# Altium schematic sheet 04-WPT-IC.SchDoc: WPT-IC
size A3; DocumentNumber: 4; SheetNumber: 4; SheetTotal: 5
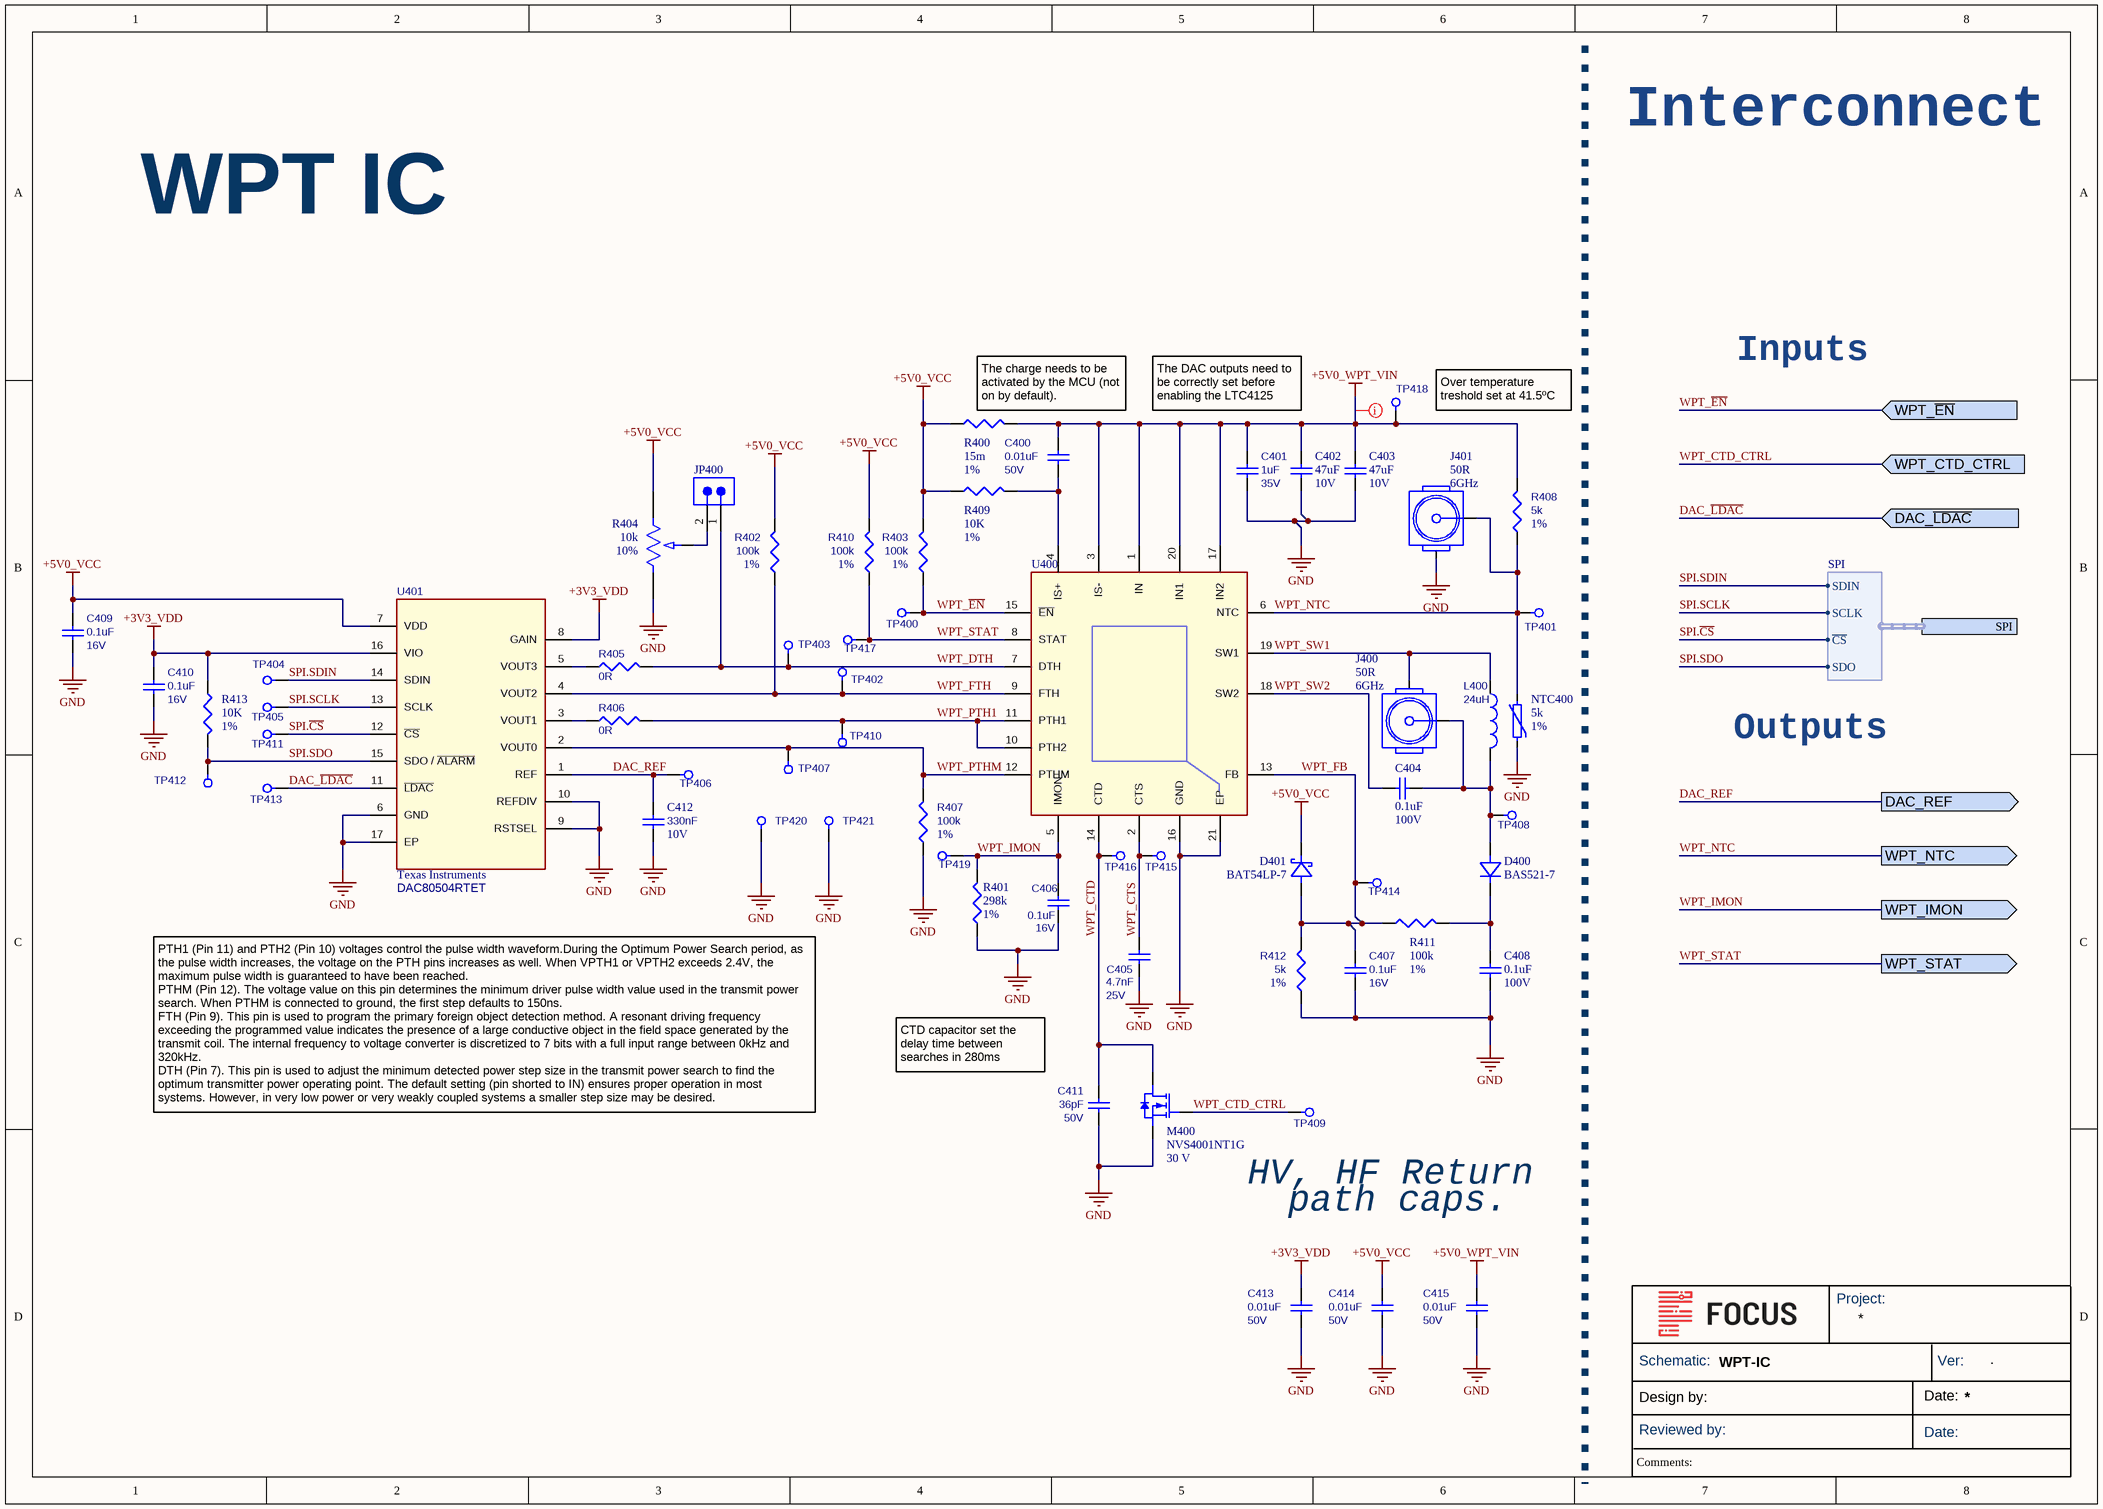
[diagram p0: 04-WPT-IC.SchDoc]

## Parts
C400  value 0.01uF  Rating: 50V  [C0402]  (hidden comment: GCM155R71H103KA55J)
C401  value 1uF  Rating: 35V  [C0402]  (hidden comment: GRM155R6YA105KE11D)
C402  value 47uF  Voltage Rating: 10V  [C0805]  (hidden comment: GRM21BR61A476ME15L)
C403  value 47uF  Voltage Rating: 10V  [C0805]  (hidden comment: GRM21BR61A476ME15L)
C404  value 0.1uF  Voltage Rating: 100V  [C1206]  (hidden comment: C3216C0G2A104J160AC)
C405  value 4.7nF  Rating: 25V  [C0402]  (hidden comment: GCM155R71E472KA37D)
C406  value 0.1uF  Rating: 16V  [C0402]  (hidden comment: GCM155R71C104KA55)
C407  value 0.1uF  Rating: 16V  [C0402]  (hidden comment: GCM155R71C104KA55)
C408  value 0.1uF  Voltage Rating: 100V  [C1206]  (hidden comment: C3216C0G2A104J160AC)
C409  value 0.1uF  Rating: 16V  [C0402]  (hidden comment: GCM155R71C104KA55)
C410  value 0.1uF  Rating: 16V  [C0402]  (hidden comment: GCM155R71C104KA55)
C411  value 36pF  Rating: 50V  [C0402]  (hidden comment: GCM1555C1H360FA16D)
C412  value 330nF  Rated DC Voltage (URdc): 10V  [C0402]  (hidden comment: GRM155R61A334KE15D)
C413  value 0.01uF  Rating: 50V  [C0402]  (hidden comment: GCM155R71H103KA55J)
C414  value 0.01uF  Rating: 50V  [C0402]  (hidden comment: GCM155R71H103KA55J)
C415  value 0.01uF  Rating: 50V  [C0402]  (hidden comment: GCM155R71H103KA55J)
D400  BAS521-7  [BAS521_SOD523]
D401  BAT54LP-7  [BAT54LP-7]
J400  Characteristic Impedance: 50R  Operating Frequency-Max: 6GHz  [FP-U_FL-R-SMT-1_10-MFG]  (hidden comment: U.FL-R-SMT-1(10))
J401  Characteristic Impedance: 50R  Operating Frequency-Max: 6GHz  [FP-U_FL-R-SMT-1_10-MFG]  (hidden comment: U.FL-R-SMT-1(10))
JP400  TSW-102-26-G-S  [SMTC-TSW-102-26-XX-S]  (value not drawn)
L400  value 24uH  [Coil_pads-5mm-ThroughHole]  (hidden comment: 760308100110)
M400  NVS4001NT1G  Vds breakdown: 30 V  [NVS4001NT1G-SC-70-3]
NTC400  value 5k  Tolerance: 1%  [NTC0603]  (hidden comment: NTCS0603E3502FLT)
R400  value 15m  Tolerance: 1%  [R0603]  (hidden comment: WSL0603R0150FEA18)
R401  value 298k  Tolerance: 1%  [R0402]  (hidden comment: RN73R1ETTP2983F50)
R402  value 100k  Tolerance: 1%  [R0402]  (hidden comment: ERJ-2RKF1003X)
R403  value 100k  Tolerance: 1%  [R0402]  (hidden comment: ERJ-2RKF1003X)
R404  value 10k  Tolerance: 10%  [RES3_64W_TTE]  (hidden comment: 64WR10KLF)
R405  value 0R  [R0402]  (hidden comment: ERJ-2GE0R00X)
R406  value 0R  [R0402]  (hidden comment: ERJ-2GE0R00X)
R407  value 100k  Tolerance: 1%  [R0402]  (hidden comment: ERJ-2RKF1003X)
R408  value 5k  Tolerance: 1%  [R0402]  (hidden comment: RC0402FR-075KL)
R409  value 10K  Tolerance: 1%  [R0402]  (hidden comment: CRCW040210K0FKED)
R410  value 100k  Tolerance: 1%  [R0402]  (hidden comment: ERJ-2RKF1003X)
R411  value 100k  Tolerance: 1%  [R0603]  (hidden comment: CRCW0603100KFKEAC)
R412  value 5k  Tolerance: 1%  [R0402]  (hidden comment: RC0402FR-075KL)
R413  value 10K  Tolerance: 1%  [R0402]  (hidden comment: CRCW040210K0FKED)
TP400  Test Point  [testpad_0.9mm]  (value not drawn)  (no BOM)
TP401  Test Point  [testpad_0.9mm]  (value not drawn)  (no BOM)
TP402  Test Point  [testpad_0.9mm]  (value not drawn)  (no BOM)
TP403  Test Point  [testpad_0.9mm]  (value not drawn)  (no BOM)
TP404  Test Point  [testpad_0.9mm]  (value not drawn)  (no BOM)
TP405  Test Point  [testpad_0.9mm]  (value not drawn)  (no BOM)
TP406  Test Point  [testpad_0.9mm]  (value not drawn)  (no BOM)
TP407  Test Point  [testpad_0.9mm]  (value not drawn)  (no BOM)
TP408  Test Point  [testpad_0.9mm]  (value not drawn)  (no BOM)
TP409  Test Point  [testpad_0.9mm]  (value not drawn)  (no BOM)
TP410  Test Point  [testpad_0.9mm]  (value not drawn)  (no BOM)
TP411  Test Point  [testpad_0.9mm]  (value not drawn)  (no BOM)
TP412  Test Point  [testpad_0.9mm]  (value not drawn)  (no BOM)
TP413  Test Point  [testpad_0.9mm]  (value not drawn)  (no BOM)
TP414  Test Point  [testpad_0.9mm]  (value not drawn)  (no BOM)
TP415  Test Point  [testpad_0.9mm]  (value not drawn)  (no BOM)
TP416  Test Point  [testpad_0.9mm]  (value not drawn)  (no BOM)
TP417  Test Point  [testpad_0.9mm]  (value not drawn)  (no BOM)
TP418  Test Point  [testpad_0.9mm]  (value not drawn)  (no BOM)
TP419  Test Point  [testpad_0.9mm]  (value not drawn)  (no BOM)
TP420  Test Point  [testpad_0.9mm]  (value not drawn)  (no BOM)
TP421  Test Point  [testpad_0.9mm]  (value not drawn)  (no BOM)
U400  LTC4125IUFD#TRPBF  [QFN50P400X500X80_HS-21N]  (value not drawn)
U401  Manufacturer: Texas Instruments  [DAC60504BRTET_16-WQFN]  (hidden comment: DAC80504RTET)

## Ports
DAC_REF (out), DAC_~{LDAC} (in), SPI (harness SPI), WPT_CTD_CTRL (in), WPT_IMON (out), WPT_NTC (out), WPT_STAT (out), WPT_~{EN} (in)

## Harnesses
SPI: SDIN, SCLK, ~{CS}, SDO

## Nets
+3V3_VDD: C410.2 C413.2 R413.1 U401.8(GAIN) U401.16(VIO)
+5V0_VCC: C409.2 C414.2 D401.1 R400.1 R402.2 R403.2 R404.1 R409.1 R410.2 U401.7(VDD)
+5V0_WPT_VIN: C400.2 C401.2 C402.2 C403.2 C415.2 R400.2 R408.2 TP418.1 U400.1(IN) U400.3(IS-) U400.17(IN2) U400.20(IN1)
GND: C401.1 C402.1 C403.1 C405.1 C406.1 C407.1 C408.1 C409.1 C410.1 C411.1 C412.1 C413.1 C414.1 C415.1 J401.2 M400.2(S) NTC400.1 R401.1 R404.3 R407.1 R412.1 TP420.1 TP421.1 U400.16(GND) U400.21(EP) U401.6(GND) U401.9(RSTSEL) U401.10(REFDIV) U401.17(EP)
DAC_~{LDAC}: TP413.1 U401.11(~{LDAC}) ; port DAC_~{LDAC}
DAC_REF: C412.2 TP406.1 U401.1(REF) ; port DAC_REF
SPI.~{CS}: TP411.1 U401.12(~{CS}) ; port SPI.~{CS}
SPI.SCLK: TP405.1 U401.13(SCLK) ; port SPI.SCLK
SPI.SDIN: TP404.1 U401.14(SDIN) ; port SPI.SDIN
SPI.SDO: R413.2 TP412.1 U401.15(SDO_/_~{ALARM}) ; port SPI.SDO
WPT_CTD: C411.2 M400.3(D) TP416.1 U400.14(CTD)
WPT_CTD_CTRL: M400.1(G) TP409.1 ; port WPT_CTD_CTRL
WPT_CTS: C405.2 TP415.1 U400.2(CTS)
WPT_DTH: JP400.1 R405.2 TP403.1 U400.7(DTH)
WPT_~{EN}: R403.1 TP400.1 U400.15(~{EN}) ; port WPT_~{EN}
WPT_FB: C407.2 D401.2 R411.1 R412.2 TP414.1 U400.13(FB)
WPT_FTH: R402.1 TP402.1 U400.9(FTH) U401.4(VOUT2)
WPT_IMON: C406.2 R401.2 TP419.1 U400.5(IMON) ; port WPT_IMON
WPT_NTC: J401.1 NTC400.2 R408.1 TP401.1 U400.6(NTC) ; port WPT_NTC
WPT_PTH1: R406.2 TP410.1 U400.10(PTH2) U400.11(PTH1)
WPT_PTHM: R407.2 TP407.1 U400.12(PTHM) U401.2(VOUT0)
WPT_STAT: R410.1 TP417.1 U400.8(STAT) ; port WPT_STAT
WPT_SW1: J400.2 L400.2 U400.19(SW1)
WPT_SW2: C404.2 U400.18(SW2)
NetC400_1: C400.1 R409.2 U400.4(IS+)
NetC404_1: C404.1 D400.2 J400.1 L400.1 TP408.1
NetC408_2: C408.2 D400.1 R411.2
NetJP400_2: JP400.2 R404.2
NetR405_1: R405.1 U401.5(VOUT3)
NetR406_1: R406.1 U401.3(VOUT1)

## Layout directives
net class POWER; rule Supply Nets [Voltage = 5.000]: +5V0_WPT_VIN

## Notes on the sheet
- Interconnect
- WPT IC
- Inputs
- (near R400) The charge needs to be activated by the MCU (not on by default).
- The DAC outputs need to be correctly set before enabling the LTC4125
- (near TP418) Over temperature treshold set at 41.5ºC
- Outputs
- PTH1 (Pin 11) and PTH2 (Pin 10) voltages control the pulse width waveform.During the Optimum Power Search period, as the pulse width increases, the voltage on the PTH pins increases as well. When VPTH1 or VPTH2 exceeds 2.4V, the maximum pulse width is guaranteed to have been reached.
  PTHM (Pin 12). The voltage value on this pin determines the minimum driver pulse width value used in the transmit power search. When PTHM is connected to ground, the first step defaults to 150ns.
  FTH (Pin 9). This pin is used to program the primary foreign object detection method. A resonant driving frequency exceeding the programmed value indicates the presence of a large conductive object in the field space generated by the transmit coil. The internal frequency to voltage converter is discretized to 7 bits with a full input range between 0kHz and 320kHz.
  DTH (Pin 7). This pin is used to adjust the minimum detected power step size in the transmit power search to find the optimum transmitter power operating point. The default setting (pin shorted to IN) ensures proper operation in most systems. However, in very low power or very weakly coupled systems a smaller step size may be desired.
- CTD capacitor set the delay time between searches in 280ms
- (near TP409) HV, HF Return
- path caps.
- Project:
- Schematic:
- Ver:
- .
- Design by:
- Reviewed by:
- Date:
- Comments:

## Library data of the parts
C400 C413-C415 = GCM155R71H103KA55J: Capacitor, 0.01uF, X7R, 50V, 10%, 0402, Implant-grade; Manufacturer: Murata; Medical Grade MFR PN: GCH155R71H103KE01; PCB Footprint: cap0402_reduced; Review: 020823; Length (mm): 1.00 ±0.05; Medical Grade MFR: Murata; Thickness (mm): 0.50 ±0.05; Width (mm): 0.50 ±0.05; Category: Capacitor; Package Description: 0402; Supplier 1: Arrow Electronics; Supplier Part Number 1: GCM155R71H103KA55J; Check: *; Status: Approved; Manufacturer Part Number: GCM155R71H103KA55J
C401 = GRM155R6YA105KE11D: 1 µF ±10% 35V Ceramic Capacitor X5R 0402 (1005 Metric); Manufacturer: Murata; Length (mm): 1.00 ±0.05; Manufacturer Part Number: GRM155R6YA105KE11D; Thickness (mm): 0.50 ±0.05; Width (mm): 0.50 ±0.05; Category: Capacitor; Package Description: 0402; Supplier 1: Digikey; Supplier Part Number 1: 490-10019-1-ND
C402 C403 = GRM21BR61A476ME15L: 47 µF ±20% 10V Ceramic Capacitor X5R 0805 (2012 Metric); Manufacturer: Murata; Category: Capacitor; Temperature Coefficient: X5R; Manufacturer Part Number: GRM21BR61A476ME15L; Size Code: 0805; Width: 1.25mm; Length: 2mm; Tolerance: 20%; Supplier 1: Digikey; Supplier Part Number 1: 490-9961-1-ND
C404 C408 = C3216C0G2A104J160AC: 0.1 µF ±5% 100V Ceramic Capacitor C0G, NP0 1206 (3216 Metric); Manufacturer: TDK Corporation; Category: Capacitor; Manufacturer Part Number: C3216C0G2A104J160AC; Size Code: 1206; Height: 1.8; Width: 1.6; Length: 3.2; Tolerance: 5%; Supplier 1: Digikey; Supplier Part Number 1: 445-172677-1-ND
C405 = GCM155R71E472KA37D: 4700 pF ±10% 25V Ceramic Capacitor X7R 0402 (1005 Metric); Manufacturer: Murata; Length (mm): 1.00 ±0.05; Manufacturer Part Number: GCM155R71E472KA37D; Thickness (mm): 0.50 ±0.05; Width (mm): 0.50 ±0.05; Category: Capacitor; Package Description: 0402; Supplier 1: Mouser; Supplier Part Number 1: 81-GCM155R71E472KA7D; Supplier 2: Digikey; Supplier Part Number 2: 490-GCM155R71E472KA37DCT-ND; Supplier 3: Digikey; Supplier Part Number 3: 490-GCM155R71E472KA37DDKR-ND; Supplier 4: Digikey; Supplier Part Number 4: 490-GCM155R71E472KA37DTR-ND
C406 C407 C409 C410 = GCM155R71C104KA55: Capacitor, 0.1uF, X7R, 16V, 10%, 0402, Implant-grade; Manufacturer: Murata; Medical Grade MFR PN: GCH155R71C104KE01; PCB Footprint: cap0402_reduced; Length (mm): 1.00 ±0.05; Manufacturer Part Number: GCM155R71C104KA55; Medical Grade MFR: Murata; Thickness (mm): 0.50 ±0.05; Width (mm): 0.50 ±0.05; Category: Capacitor; Package Description: 0402; Supplier 1: Digikey; Supplier Part Number 1: 490-4759-1-ND
C411 = GCM1555C1H360FA16D: 36 pF ±1% 50V Ceramic Capacitor C0G, NP0 0402 (1005 Metric); Manufacturer: Murata; Length (mm): 1.00 ±0.05; Manufacturer Part Number: GCM1555C1H360FA16D; Thickness (mm): 0.50 ±0.05; Width (mm): 0.50 ±0.05; Category: Capacitor; Package Description: 0402; Supplier 1: Digikey; Supplier Part Number 1: 490-GCM1555C1H360FA16DCT-ND
C412 = GRM155R61A334KE15D: Ceramic Capacitor, Multilayer, Ceramic, 10V, 10% +Tol, 10% -Tol, X5R, 15% TC, 0.33uF, Surface Mount, 0402; Manufacturer: Murata; Multilayer: Yes; Supplier: Arrow Electronics; Supplier Part Number: GRM155R61A334KE15D; Manufacturer Part Number: GRM155R61A334KE15D; RoHS: Yes; Category: Ceramic Capacitors; Stock: 42823; Pricing: 1=0,1103, 10=0,0933, 25=0,0752, 100=0,0508, 250=0,0502, 500=0,0438, 1000=0,0295, 3000=0,028, 6000=0,025, 15000=0,0191, 30000=0,0185 (USD); Mounting Technology: Surface Mount; Pins: 2; Dielectric Material: Ceramic; Package Shape: Rectangular; Case/Package: 0402; Terminal Finish: Nickel; Min Operating Temperature: -55°C; Max Operating Temperature: 85°C; JESD-609 Code: e3; Capacitor Type: Ceramic; Tolerance  (fill in as +-): 10%; Package Style: SMTMeter; Packaging: Tape and Reel; Tolerance (fill in as +-): 10%; Temperature Characteristics Code: X5R; Termination: Wraparound; Length: 1mm; Width: 0.5mm; Height: 0.5mm; Reach SVHC Compliant: Yes; RoHS Compliant: Yes; ComponentLink1URL: https://datasheet.ciiva.com:443/pdfs/VipMasterIC/IC/MURE/MURE-S-A0004362469/MURE-S-A0004364266-1.pdf?src-supplier=IHS+Markit; ComponentLink1Description: https://datasheet.ciiva.com:443/pdfs/VipMasterIC/IC/MURE/MURE-S-A0004362469/MURE-S-A0004364266-1.pdf?src-supplier=IHS+Markit; ComponentLink2URL: https://datasheet.ciiva.com/133/product-133232.pdf?src-supplier=Digi-Key; ComponentLink2Description: https://datasheet.ciiva.com/133/product-133232.pdf?src-supplier=Digi-Key; ComponentLink3URL: https://datasheet.ciiva.com/18184/getdatasheetpartid-223890-18184604.pdf?src-supplier=Verical; ComponentLink3Description: https://datasheet.ciiva.com/18184/getdatasheetpartid-223890-18184604.pdf?src-supplier=Verical; ComponentLink4URL: https://datasheet.ciiva.com/29200/453519-da-01-en-vs-kondensator-0402-29200242.pdf?src-supplier=Conrad; ComponentLink4Description: https://datasheet.ciiva.com/29200/453519-da-01-en-vs-kondensator-0402-29200242.pdf?src-supplier=Conrad; ComponentLink5URL: https://datasheet.ciiva.com/133/grm155r61a334ke15-01-133233.pdf?src-supplier=Digi-Key; ComponentLink5Description: https://datasheet.ciiva.com/133/grm155r61a334ke15-01-133233.pdf?src-supplier=Digi-Key; ComponentLink6URL: https://datasheet.ciiva.com/5421/product-5421467.pdf?src-supplier=Mouser; ComponentLink6Description: https://datasheet.ciiva.com/5421/product-5421467.pdf?src-supplier=Mouser; ComponentLink7URL: https://datasheet.ciiva.com/11463/product-11463963.pdf?src-supplier=Avnet; ComponentLink7Description: https://datasheet.ciiva.com/11463/product-11463963.pdf?src-supplier=Avnet; Supplier 1: Mouser; Supplier Part Number 1: 81-GRM155R61A334KE5D; Supplier 2: Digikey; Supplier Part Number 2: 490-3263-1-ND; Supplier 3: Digikey; Supplier Part Number 3: 490-3263-6-ND; Supplier 4: Digikey; Supplier Part Number 4: 490-3263-2-ND
D400 = BAS521-7: Diode 300 V 250mA Surface Mount SOD-523; Manufacturer: Diodes Incorporated; Type: General Purpose; Number of Channels: 1; Forward Voltage: 1.1V; Reverse Voltage: 300V; Reverse Current: 150nA; Diode Capacitance: 5pF; Category: Diode; Manufacturer Part Number: BAS521-7; Mounting Type: SMD; Forward Current: 250mA; Supplier 1: Digikey; Supplier Part Number 1: BAS521-7DICT-ND
D401 = BAT54LP-7: Diode 30 V 200mA Surface Mount X1-DFN1006-2; Manufacturer: Diodes Incorporated; Forward Voltage: 1V; Reverse Voltage: 30V; Reverse Leakage urrent: 2uA; Manufacturer Part Number: BAT54LP-7; Current: 200mA; Mounting type: SMD; Supplier 1: Digikey; Supplier Part Number 1: BAT54LPDICT-ND
J400 J401 = U.FL-R-SMT-1(10): RF Connector, 1 Contact(s), Male, Board Mount, Surface Mount Terminal, Receptacle; pin to pad: 2>2+3; Manufacturer: Hirose; Durability: 30Cycles; Insulation Resistance: 500MR; Number of Ports: 1; Option: General Purpose; Contact Resistance: 20mR; Contact Style: Coax; Coupling Type: Snap; Dielectric Withstanding Voltage (AC): 200V; Filter Feature: No; Mating Information: MULTIPLE MATING PARTS AVAILABLE; Panel Mount: No; VSWR: 1.5; Insertion Loss: 0.05dB; Body Depth: 0.098inch; Mounting Option 1: LOCKING; Body Diameter: 0.079inch; Reference Standard: UL; Reliability: COMMERCIAL; Supplier: Digi-Key; Supplier Part Number: H11891CT-ND; RoHS: Yes; Category: RF / Coaxial Connectors; Stock: 112692; Pricing: 1=1,35, 10=1,138, 25=1,092, 50=1,0686, 100=1,0221, 250=0,9292, 500=0,83628, 1000=0,74336 (USD); Mounting Technology: Board; Insulation Material: Polymer; Shell Finish: Silver; Shell Material: CuSn; Contact Material: Bronze; Contact Finish - Mating: GOLD; Contact Finish - Termination: GOLD; Insulation Color: Beige; Min Operating Temperature: -40°C; Max Operating Temperature: 90°C; Connector Type: RF CONNECTOR; Body/Shell Style: RECEPTACLE; Contact Gender: Male; Mounting Style: STRAIGHT; Termination: SMD/SMT; Number of Contacts: 1; JESD-609 Code: e4; Reach SVHC Compliant: Yes; RoHS Compliant: Yes; DIN Conformance: No; IEC Conformance: No; MIL Conformance: No; ComponentLink1URL: https://datasheet.ciiva.com:443/pdfs/VipMasterIC/IC/HIRO/HIROS10696/HIROS08829-1.pdf?src-supplier=IHS+Markit; ComponentLink1Description: https://datasheet.ciiva.com:443/pdfs/VipMasterIC/IC/HIRO/HIROS10696/HIROS08829-1.pdf?src-supplier=IHS+Markit; ComponentLink2URL: https://datasheet.ciiva.com/11762/0900766b8105243f-11762474.pdf?src-supplier=Rs; ComponentLink2Description: https://datasheet.ciiva.com/11762/0900766b8105243f-11762474.pdf?src-supplier=Rs; ComponentLink3URL: https://datasheet.ciiva.com/7651/91524-7651914.pdf?src-supplier=Element14; ComponentLink3Description: https://datasheet.ciiva.com/7651/91524-7651914.pdf?src-supplier=Element14; ComponentLink4URL: https://datasheet.ciiva.com/7651/91524-7651915.pdf?src-supplier=Element14; ComponentLink4Description: https://datasheet.ciiva.com/7651/91524-7651915.pdf?src-supplier=Element14; Manufacturer Part Number: U.FL-R-SMT-1(10); Supplier 1: Digikey; Supplier Part Number 1: H11891CT-ND
JP400 = TSW-102-26-G-S: Conn Unshrouded Header HDR 2 POS 2.54mm Solder ST Thru-Hole; Manufacturer: Samtec; Number of Contacts: 2; Gender: Male; Max Current Rating: 7.6A; Max Voltage Rating (AC): 550V; Orientation: Vertical; ComponentLink3Description: Package Specification; PackageReference: TSW-102-26-XX-S; Mounting Technology: Through-hole; ComponentLink2Description: Datasheet; ComponentLink1URL: http://www.samtec.com; DatasheetVersion: F-214; ComponentLink1Description: Manufacturer URL; RoHS: True; ComponentLink2URL: http://www.samtec.com/documents/webfiles/pdf/TSW_TH.PDF; PartNumber: TSW-102-26-G-S; ComponentLink3URL: http://www.samtec.com/documents/webfiles/cpdf/TSW-XXX-XX-XXX-X-XX-XXX-MKT.pdf; Pitch: 2.54 mm; PackageDescription: .025[0.64] SQ. Post Terminal Strip Assembly; PackageVersion: DM, 8/1988; Temperature Range: -55 to 125 degC; Supplier: Newark; Supplier Part Number: 12P1301; Manufacturer Part Number: TSW-102-26-G-S; Category: Connectors; Stock: 3117; Pricing: 1=0.51000, 10=0.47500, 100=0.33200, 500=0.28400, 1000=0.23700, 2500=0.21000, 5000=0.20400 (USD); Contact Plating: Gold; Contact Material: Bronze; Color: Black; Housing Material: Polyester; Contact Shape: Square; Contact Finish - Mating: GOLD; Insulation Color: Black; Insulation Material: PBT; Housing Color: Black; Min Operating Temperature: -55°C; Max Operating Temperature: 125°C; Number of Rows: 1; Packaging: Bulk; Termination: Solder; Number of Positions: 2; Connector Type: Header; Series: TSW; Contact Type: Male Pin; Fastening Type: Pull; Package Quantity: 1; Length: 5.08mm; Width: 2.54mm; Contact Mating Length: 0.23inch; Depth: 2.54mm; Radiation Hardening: No; RoHS Compliant: Yes; Flammability Rating: UL94 V-0; Lead Free: Lead Free; Reach SVHC Compliant: Yes; ComponentLink4URL: https://datasheet.ciiva.com/10281/htsw-th-10281416.pdf?src-supplier=Avnet; ComponentLink4Description: https://datasheet.ciiva.com/10281/htsw-th-10281416.pdf?src-supplier=Avnet; ComponentLink5URL: https://datasheet.ciiva.com/6887/tsw-xxx-xx-xxx-x-xx-xxx-mkt-6887237.pdf?src-supplier=Digi-Key; ComponentLink5Description: https://datasheet.ciiva.com/6887/tsw-xxx-xx-xxx-x-xx-xxx-mkt-6887237.pdf?src-supplier=Digi-Key; Supplier 1: Digikey; Supplier Part Number 1: SAM1077-02-ND
L400 = 760308100110: 1 Coil, 2 Layer 24µH Wireless Charging Coil Transmitter 70mOhm; Manufacturer: Wurth; Rating: 6A; Category: Coil; Diameter: 50mm; Manufacturer Part Number: 760308100110; Thickness: 6mm; Supplier 1: Digikey; Supplier Part Number 1: 732-5283-ND
M400 = NVS4001NT1G: N-Channel 30 V 270mA (Ta) 330mW (Ta) Surface Mount SC-70-3 (SOT323); Manufacturer: onsemi; Number of Channels: 1; Vgs max: ±20V; Vgs th: 1.2V; Rds On: 1Ohm; Category: Transistor; Type: N-MOS; Mounting Type: SMD; Power Dissipation: 330mW; Id, drain  DC current max: 270mA; Manufacturer Part Number: NVS4001NT1G; Supplier 1: Digikey; Supplier Part Number 1: NVS4001NT1GOSCT-ND
NTC400 = NTCS0603E3502FLT: NTC SMD 0603, 5KOHM, 1%, B25/85; Manufacturer: Vishay Dale; Max Power: 100mW; Manufacturer Part Number: NTCS0603E3502FLT; B Tolerance: 1%; Operating Temperature: 40°C ~ 125°C; Mounting Type: Surface Mount; Package: 0603; Supplier 1: Mouser; Supplier Part Number 1: 594-NTCS0603E3502FLT; Supplier 2: Digikey; Supplier Part Number 2: 541-NTCS0603E3502FLTCT-ND; Supplier 3: Digikey; Supplier Part Number 3: 541-NTCS0603E3502FLTTR-ND
R400 = WSL0603R0150FEA18: 15 mOhms ±1% 0.2W, 1/5W Chip Resistor 0603 (1608 Metric) Automotive AEC-Q200, Current Sense, Moisture Resistant, Pulse Withstanding Metal Element; Manufacturer: Vishay Dale; Power: 200mW; Temperature Coefficient: ±75ppm/°C; Category: Resistor; Manufacturer Part Number: WSL0603R0150FEA18; Size Code: 0603; Height: 0.53mm; Width: 0.76mm; Length: 1.52mm; Supplier 1: Digikey; Supplier Part Number 1: WSLL-.015CT-ND
R401 = RN73R1ETTP2983F50: 298 kOhms ±1% 0.063W, 1/16W Chip Resistor 0402 (1005 Metric) Automotive AEC-Q200, Moisture Resistant Thin Film; Manufacturer: KOA Speer Electronics, Inc.; Temperature Coefficient: ±50ppm/°C; Category: Resistor; Power: 0.063W; Manufacturer Part Number: RN73R1ETTP2983F50; Size Code: 0402; Height: 0.40mm; Width: 1.00mm; Length: 0.50mm; Supplier 1: Digikey; Supplier Part Number 1: 2019-RN73R1ETTP2983F50CT-ND
R402 R403 R407 R410 = ERJ-2RKF1003X: Resistor, 100k, 1%, 0402, Implant-grade; Manufacturer: Panasonic; Medical Grade MFR: Mini-Systems; Medical Grade MFR PN: WA20SM-1003F-NS62TRX; PCB Footprint: res0402_reduced; Rating: 40V; Review: 020823; Length (mm): 1.12 ±0.10; Thickness (mm): 0.33 ±0.08; Width (mm): 0.56 ±0.08; Category: Resistor; Supplier 1: Mouser; Supplier Part Number 1: 667-ERJ-2RKF1003X; Status: Approved; Manufacturer Part Number: ERJ-2RKF1003X
R404 = 64WR10KLF: 10 kOhms 0.25W, 1/4W PC Pins Through Hole Trimmer Potentiometer Cermet 12.0 Turn Top Adjustment; Manufacturer: TT Electronics/BI; Temperature Coefficient: ±100ppm/°C; Number of turns: 12; Category: Resistor; Power: 0.25W; Manufacturer Part Number: 64WR10KLF; Height: 6.86mm; Width: 4.19mm; Length: 6.35mm; Supplier 1: Digikey; Supplier Part Number 1: 987-1061-ND
R405 R406 = ERJ-2GE0R00X: Resistor, Zero ohms, 40V, 40mW, 1%, 0402, Implant-grade; Manufacturer: Panasonic; Medical Grade MFR: Mini-Systems; Medical Grade MFR PN: WAJ20PG-NS62TRX; PCB Footprint: res0402_reduced; Review: 020823; Length (mm): 1.12 ±0.10; Rating: 40V; Thickness (mm): 0.33 ±0.08; Width (mm): 0.56 ±0.08; Category: Resistor; Package Description: TBD; Supplier 1: Mouser; Supplier Part Number 1: 667-ERJ-2GE0R00X; Status: Approved; Tolerance: 1%; Manufacturer Part Number: ERJ-2GE0R00X
R408 R412 = RC0402FR-075KL: 5 kOhms ±1% 0.063W, 1/16W Chip Resistor 0402 (1005 Metric) Moisture Resistant Thick Film; Manufacturer: Yageo; Rating: 40V; Thickness (mm): 0.33 ±0.08; Width (mm): 0.56 ±0.08; Category: Resistor; Package Description: 0402; Supplier 1: Digikey; Supplier Part Number 1: 13-RC0402FR-075KLCT-ND; Manufacturer Part Number: RC0402FR-075KL
R409 R413 = CRCW040210K0FKED: Res Thick Film 0402 10K Ohm 1% 1/16W ±100ppm/°C Molded SMD SMD Paper T/R; Manufacturer: Vishay Dale; Power Rating: 63mW; Voltage Rating: 50V; Case Code (Metric): 1005; Features: Automotive AEC-Q200; Termination: SMD/SMT; Mount: Surface Mount; Case Code (Imperial): 0402; Lead Free: Lead Free; Max Power Dissipation: 63mW; Number of Terminations: 2; Number of Pins: 2; Composition: Thick Film; Case/Package: 0402; Temperature Coefficient: 100ppm/°C; Min Operating Temperature: -55°C; Max Operating Temperature: 155°C; Manufacturer Part Number: CRCW040210K0FKED; RoHS: Yes; Category: Chip SMD Resistors; Stock 1: 17500; Pricing 1: 100=0.04700, 500=0.04400, 1000=0.04000, 2500=0.03700, 5000=0.03300 (GBP); Resistor Type: Thick Film; Series: CRCW-HP; Ratings: AEC-Q200; RoHS Compliant: Yes; ComponentLink1URL: https://datasheet.ciiva.com/9052/crcwhpe3-9052616.pdf?src-supplier=Avnet; ComponentLink1Description: https://datasheet.ciiva.com/9052/crcwhpe3-9052616.pdf?src-supplier=Avnet; ComponentLink2URL: https://datasheet.ciiva.com/5550/crcwhpe3-46056-5550367.pdf?src-supplier=Mouser; ComponentLink2Description: https://datasheet.ciiva.com/5550/crcwhpe3-46056-5550367.pdf?src-supplier=Mouser; ComponentLink3URL: https://datasheet.ciiva.com/7725/crcwhpe3-7725759.pdf?src-supplier=Element14; ComponentLink3Description: https://datasheet.ciiva.com/7725/crcwhpe3-7725759.pdf?src-supplier=Element14; ComponentLink4URL: https://datasheet.ciiva.com/28588/1750852-28588877.pdf?src-supplier=Element14; ComponentLink4Description: https://datasheet.ciiva.com/28588/1750852-28588877.pdf?src-supplier=Element14; Supplier 1: Digikey; Supplier Part Number 1: 541-10.0KLCT-ND
R411 = CRCW0603100KFKEAC: 100 kOhms ±1% 0.1W, 1/10W Chip Resistor 0603 (1608 Metric) Automotive AEC-Q200 Thick Film; Manufacturer: Vishay; Power: 100mW; Manufacturer Part Number: CRCW0603100KFKEAC; RoHS: Yes; Category: Chip SMD Resistors; Mounting Technology: Surface Mount; Pins: 2; Package Shape: Rectangular; Case/Package: 0603; Terminal Finish: Nickel; Min Operating Temperature: -55°C; Max Operating Temperature: 155°C; Construction: Chip; ComponentLink1URL: https://datasheet.ciiva.com:443/pdfs/VipMasterIC/IC/VISH/VISH-S-A0002932828/VISH-S-A0002932828-1.pdf?src-supplier=IHS+Markit; ComponentLink1Description: https://datasheet.ciiva.com:443/pdfs/VipMasterIC/IC/VISH/VISH-S-A0002932828/VISH-S-A0002932828-1.pdf?src-supplier=IHS+Markit; ComponentLink2URL: https://datasheet.ciiva.com/2471/crcw0201e3-2471712.pdf?src-supplier=Digikey; ComponentLink2Description: https://datasheet.ciiva.com/2471/crcw0201e3-2471712.pdf?src-supplier=Digikey; ComponentLink3URL: https://datasheet.ciiva.com/7841/1719906-7841431.pdf?src-supplier=Element14; ComponentLink3Description: https://datasheet.ciiva.com/7841/1719906-7841431.pdf?src-supplier=Element14; ComponentLink4URL: https://datasheet.ciiva.com/7841/1719906-7841430.pdf?src-supplier=Element14; ComponentLink4Description: https://datasheet.ciiva.com/7841/1719906-7841430.pdf?src-supplier=Element14; ComponentLink5URL: https://datasheet.ciiva.com/22665/1847332-22665688.pdf?src-supplier=Element14; ComponentLink5Description: https://datasheet.ciiva.com/22665/1847332-22665688.pdf?src-supplier=Element14; ComponentLink6URL: https://datasheet.ciiva.com/2471/crcw0201e3-2471713.pdf?src-supplier=Digikey; ComponentLink6Description: https://datasheet.ciiva.com/2471/crcw0201e3-2471713.pdf?src-supplier=Digikey; ComponentLink7URL: https://datasheet.ciiva.com/2471/crcw0201e3-2471711.pdf?src-supplier=Digikey; ComponentLink7Description: https://datasheet.ciiva.com/2471/crcw0201e3-2471711.pdf?src-supplier=Digikey; ComponentLink8URL: https://datasheet.ciiva.com/16757/70202042-16757849.pdf?src-supplier=Allied+Electronics; ComponentLink8Description: https://datasheet.ciiva.com/16757/70202042-16757849.pdf?src-supplier=Allied+Electronics; ComponentLink9URL: https://datasheet.ciiva.com/16436/crcw0201e3-16436237.pdf?src-supplier=Future+Electronics; ComponentLink9Description: https://datasheet.ciiva.com/16436/crcw0201e3-16436237.pdf?src-supplier=Future+Electronics; Supplier 1: Digikey; Supplier Part Number 1: 541-3950-1-ND
TP400-TP421 = Test Point: Test pad, 0.90mm circular pad; PCB Footprint: testpad_0p90mm; Length (mm): 0.90; Manufacturer: N/A; Manufacturer PN: N/A; Medical Grade MFR: N/A; Medical Grade MFR PN: N/A; Rating: N/A; Thickness (mm): N/A; Value: Test point; Width (mm): 0.90; Category: Test point; Status: *; Review: *
U400 = LTC4125IUFD#TRPBF: 5W Autoresonant Wireless Power Transmitter PMIC 20-QFN (4x5); Manufacturer: Analog Devices Inc.; Current supply: 1mA; Voltage supply: 3V ~ 5.5V; Manufacturer Part Number: LTC4125IUFD#TRPBF; Category: Wireless Power Transmitter; Operating Temperature: -40°C ~ 125°C; Package: 20-WFQFN Exposed Pad; Mounting type: Surface Mount; Supplier 1: Digikey; Supplier Part Number 1: 505-LTC4125IUFD#TRPBFCT-ND
U401 = DAC80504RTET: 16 Bit Digital to Analog Converter 4 16-WQFN (3x3); Rating: 2.7-5.5V; Category: IC; Length (mm): 2.50 ±0.10; Manufacturer Part Number: DAC80504RTET; Thickness (mm): 0.75 ±0.05; Width (mm): 2.50 ±0.10; Supplier 1: Digikey; Supplier Part Number 1: 296-DAC80504RTETCT-ND; Value: DAC80504RTET